# Altium schematic sheet acc.SchDoc: Activity Tracker - Accelerometer
size A4; DrawnBy: Lukas Gasser; DocumentNumber: 3; SheetNumber: 3; SheetTotal: 3
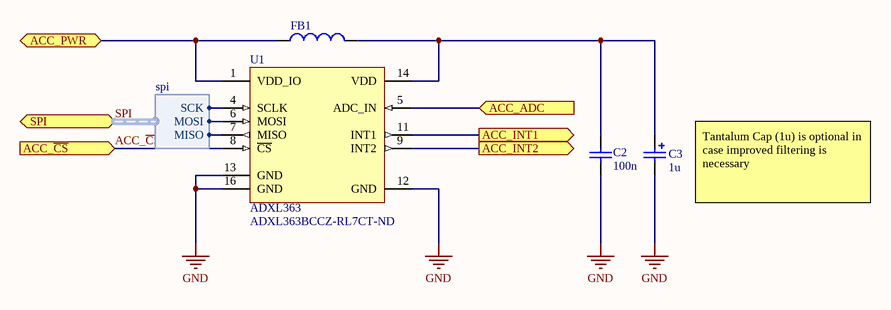
[diagram p0: acc.SchDoc]

## Parts
C2  100n  [CAPC1608X95N]
C3  1u  [CAPC1608X95N_POL]
FB1  (no value)  [RESC1608X55N]
U1  ADXL363  Supplier Part Number 1: ADXL363BCCZ-RL7CT-ND  [LGA_ADXL363]

## Ports
ACC_ADC (in), ACC_INT1 (out), ACC_INT2 (out), ACC_PWR, ACC_~{CS} (in), SPI (harness spi)

## Harnesses
spi: MISO, SCK, MOSI

## Nets
GND: C2.1 C3.2 U1.12(GND) U1.13(GND) U1.16(GND)
ACC_ADC: U1.5(ADC_IN) ; port ACC_ADC
ACC_~{CS}: U1.8(~{CS}) ; port ACC_~{CS}
ACC_INT1: U1.11(INT1) ; port ACC_INT1
ACC_INT2: U1.9(INT2) ; port ACC_INT2
ACC_PWR: FB1.1 U1.1(VDD_IO) ; port ACC_PWR
SPI.MISO: U1.7(MISO) ; port SPI.MISO
SPI.MOSI: U1.6(MOSI) ; port SPI.MOSI
SPI.SCK: U1.4(SCLK) ; port SPI.SCK
NetC2_2: C2.2 C3.1 FB1.2 U1.14(VDD)

Not connected (* = marked no-connect by the designer): U1 2(NC) 3(RES) 10(RES) 15(NC)

## Buses and harness runs
harness SPI = port SPI

## Notes on the sheet
- (near C3) Tantalum Cap (1u) is optional in case improved filtering is necessary

## Library data of the parts
C2 = C: Capacitor; Voltage: 16V; Value: 100n; Supplier 1: Digi-Key; Supplier Part Number 1: 311-1088-1-ND
C3 = CPOL: Polarized Capacitor (Surface Mount); Voltage: 16V; Value: 1u; Supplier 1: Digi-Key; Supplier Part Number 1: 478-8658-1-ND
FB1 = FB: Ferrite Bead; Supplier 1: Digi-Key; Supplier Part Number 1: 587-1895-1-ND
U1 = ADXL363: Micropower 3-Sensor Combination  Including Acceleration and Temperature; Supplier 1: Digi-Key